# EAGLE design PaxInstruments-T100 (EAGLE 6.5.0)
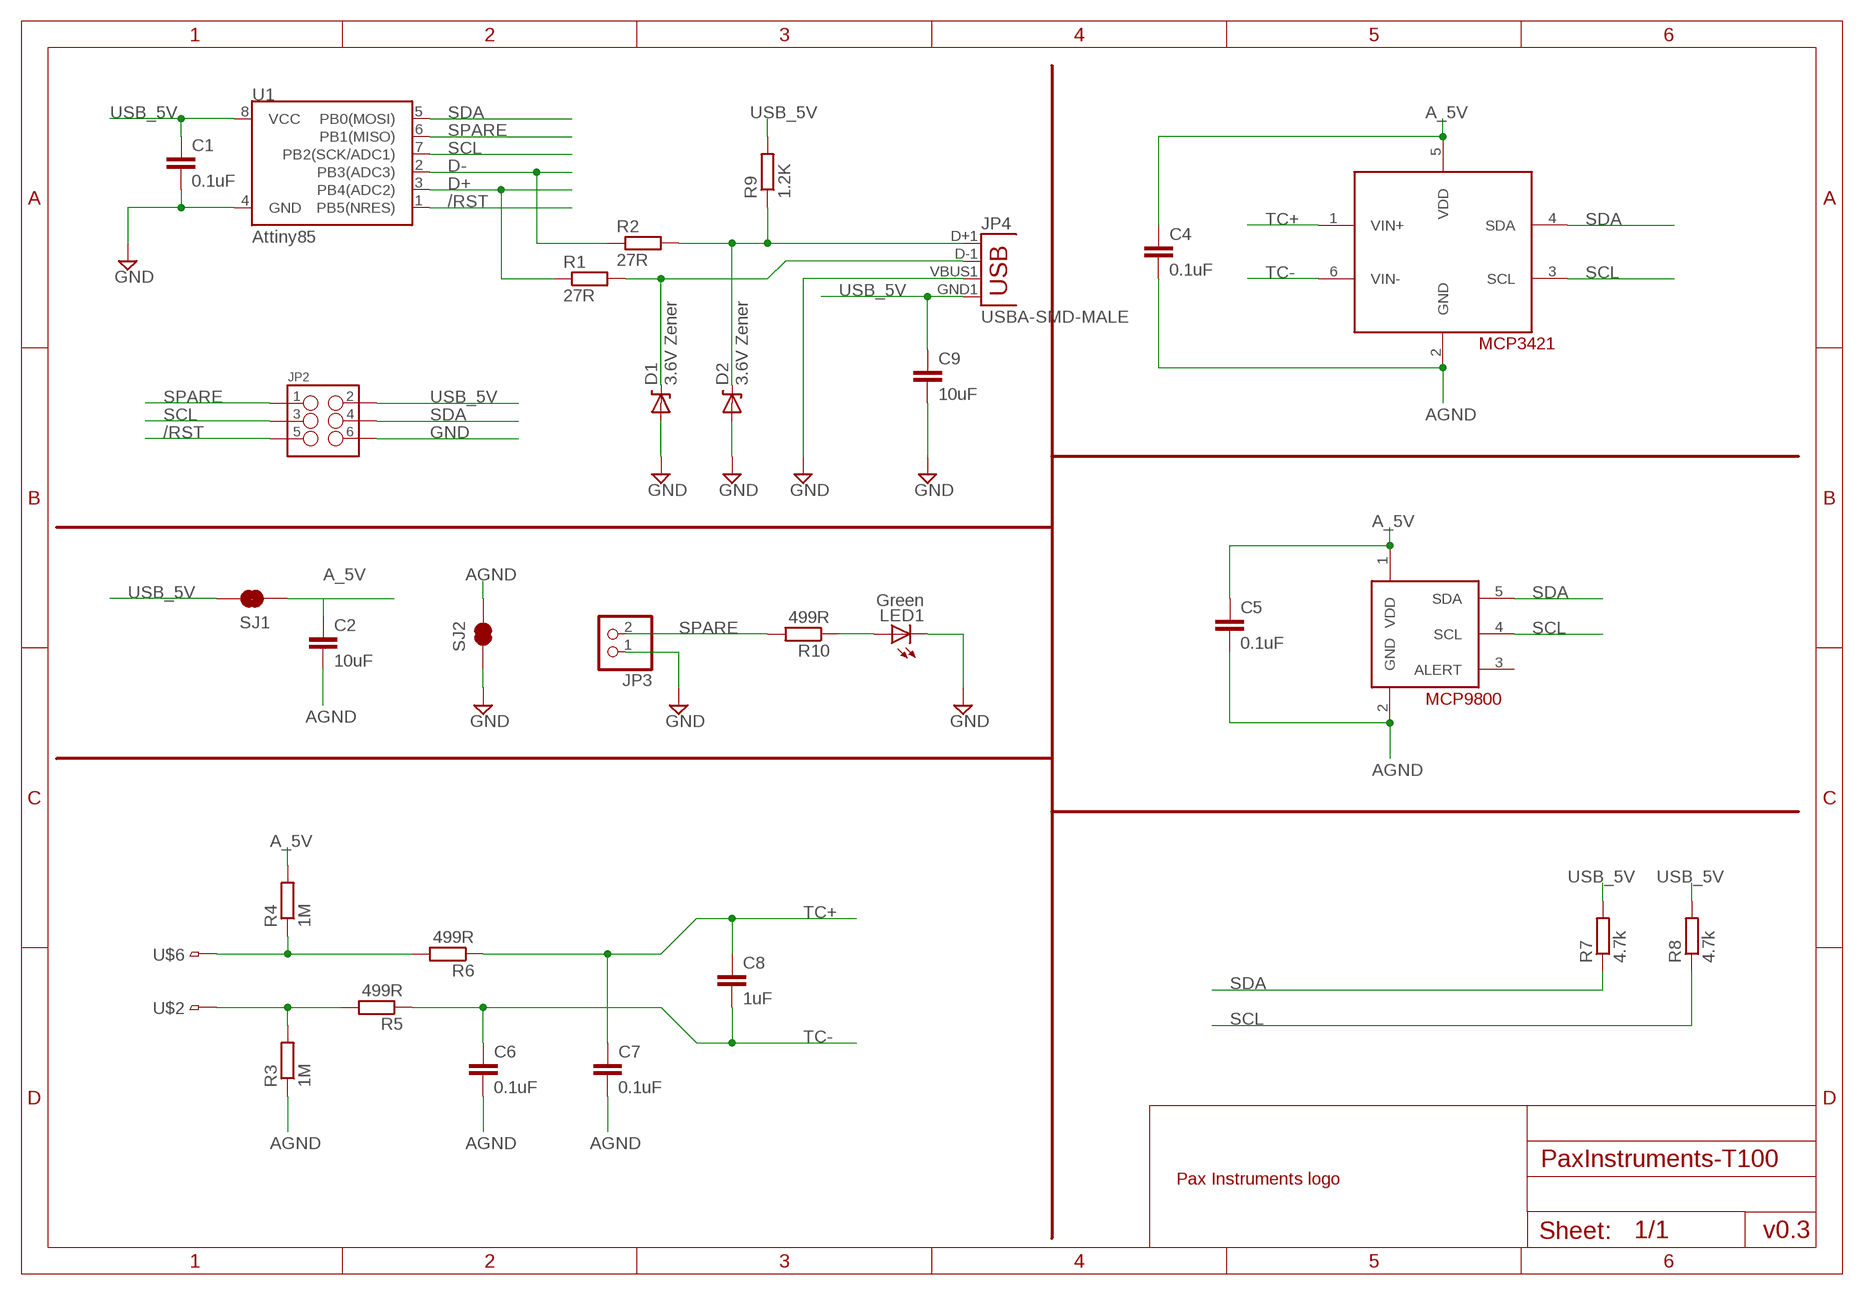
[diagram p0: schematic, sheet 1]

## Parts
C1  0.1uF  C-EUC0603  [C0603]
C2  10uF  CAP1206  [1206]
C4  0.1uF  C-EUC0603  [C0603]
C5  0.1uF  C-EUC0603  [C0603]
C6  0.1uF  C-EUC0603  [C0603]
C7  0.1uF  C-EUC0603  [C0603]
C8  1uF  C-EUC0603  [C0603]
C9  10uF  CAP1206  [1206]
D1  3.6V Zener  DIODE-ZENER-BZT52  [SOD-323]
D2  3.6V Zener  DIODE-ZENER-BZT52  [SOD-323]
JP2  M03X2SMT  [2X3_SMT_POSTS]
JP3  HEADER-1X2ROUND  [1X02_ROUND]
JP4  USBA-SMD-MALE  [USB-A-SMT-MALE]
LED1  Green  LED0603  [LED-0603]
R1  27R  R-EU_R0603  [R0603]
R2  27R  R-EU_R0603  [R0603]
R3  1M  R-EU_R0603  [R0603]
R4  1M  R-EU_R0603  [R0603]
R5  499R  R-EU_R0603  [R0603]
R6  499R  R-EU_R0603  [R0603]
R7  4.7k  R-EU_R0603  [R0603]
R8  4.7k  R-EU_R0603  [R0603]
R9  1.2K  R-EU_R0603  [R0603]
R10  499R  R-EU_R0603  [R0603]
SJ1  JUMPER-PAD-2-NC_BY_TRACENO_SILK  [PAD-JUMPER-2-NC_BY_TRACE_NO_SILK]
SJ2  JUMPER-PAD-2-NC_BY_TRACENO_SILK  [PAD-JUMPER-2-NC_BY_TRACE_NO_SILK]
U1  Attiny85  ATTINY45TINY45-20-SMT  [SO08-EIAJ]
U$1  PAX-LOGOPAX-LOGO-0.25IN  [PAX-LOGO-0.25IN]
U$2  TC-MINI-SINGLE  [TC-CLIP-SINGLE]
U$3  MCP3421A0  MCP3421  [SOT23-6]
U$4  MCP9800A0  MCP9800  [SOT23-5]
U$6  TC-MINI-SINGLE  [TC-CLIP-SINGLE]

## Nets
/RST: JP2.5 U1.1(PB5(NRES))
A_5V: C2.1 C4.1 C5.1 R4.2 SJ1.1 U$3.5(VDD) U$4.1(VDD)
AGND: C2.2 C4.2 C5.2 C6.2 C7.2 R3.1 SJ2.2 U$3.2(GND) U$4.2(GND)
D+: R1.1 U1.3(PB4(ADC2))
D-: R2.1 U1.2(PB3(ADC3))
GND: C1.2 C9.2 D1.2(A) D2.2(A) JP2.6 JP3.1 JP4.VBUS1(VBUS) LED1.C SJ2.1 U1.4(GND)
N$1: D2.1(C) JP4.D+1(D+) R2.2 R9.1
N$2: D1.1(C) JP4.D-1(D-) R1.2
N$3: R3.2 R5.2 U$2.P$1
N$4: R4.1 R6.2 U$6.P$1
N$5: LED1.A R10.1
SCL: JP2.3 R8.1 U1.7(PB2(SCK/ADC1)) U$3.3(SCL) U$4.4(SCL)
SDA: JP2.4 R7.1 U1.5(PB0(MOSI)) U$3.4(SDA) U$4.5(SDA)
SPARE: JP2.1 JP3.2 R10.2 U1.6(PB1(MISO))
TC+: C7.1 C8.1 R6.1 U$3.1(VIN+)
TC-: C6.1 C8.2 R5.1 U$3.6(VIN-)
USB_5V: C1.1 C9.1 JP2.2 JP4.GND1(GND) R7.2 R8.2 R9.2 SJ1.2 U1.8(VCC)
Unconnected: U$4.3(ALERT)

## Notes on the sheet
- v0.3

## Library data of the parts
C1 C4-C7 = rcl:C-EU: CAPACITOR, European symbol; MF: Yageo; MPN: CC0603JRX7R9BB104; OC_DIGIKEY: 311-1779-2-ND; POPULATE: generic; TOLERANCE: 5%
C2 C9 = SparkFun-Passives:CAP: Capacitor Standard 0603 ceramic capacitor, and 0.1" leaded capacitor.; MF: Yageo; MPN: CC1206KKX5R7BB106; OC_DIGIKEY: 311-1465-2-ND; POPULATE: generic; TOLERANCE: 10%
C8 = rcl:C-EU: CAPACITOR, European symbol; MF: Murata Electronics North America; MPN: GRM155R60J105KE19D; OC_DIGIKEY: 490-1320-2-ND; POPULATE: generic; TOLERANCE: 10%
D1 D2 = SparkFun-DiscreteSemi:DIODE-ZENER: Zener Diode Production Part - 8199 3.4V Zener Voltage; MF: Diodes Incorporated; MPN: BZT52C3V6S-7-F; OC_DIGIKEY: BZT52C3V6S-FDITR-ND; POPULATE: generic
JP2 = SparkFun-Connectors:M03X2: 2x3 .1" header. Shrouded, with keying- CONN-10681 SMT- CONN-11415 Pogo pins- HW-11044; MF: FCI; MPN: 95278-101A06LF; OC_DIGIKEY: 609-3487-2-ND; POPULATE: DNP; PROD_ID: CONN-11415
JP3 = microbuilder:HEADER-1X2: PIN HEADER; POPULATE: DNP
JP4 = SparkFun-Connectors:USB: USB Connectors USB-B-PTH is fully proven SKU : PRT-00139/CONN-08278 USB-miniB is fully proven SKU : PRT-00587 USB-A-PCB is untested. USB-A-H is throughly reviewed, but untested. Spark Fun Electronics SKU : PRT-00437 USB-B-SMT is throughly reviewed, but untested. Needs silkscreen touching up. USB-A-S has not been used/tested USB-MB-H has not been used/tested USB-MICROB has been used. CONN-09505
LED1 = SparkFun-LED:LED: LEDs Standard schematic elements and footprints for 5mm, 3mm, 1206, and 0603 sized LEDs. 5mm - Spark Fun Electronics SKU : COM-00529 (and others); MF: Lite-On Inc.; MPN: LTST-C191KGKT; OC_DIGIKEY: 160-1446-2-ND; POPULATE: generic
R1 R2 = rcl:R-EU_: RESISTOR, European symbol; MF: Yageo; MPN: RC0603JR-0727RL; OC_DIGIKEY: 311-27GRTR-ND; POPULATE: generic; TOLERANCE: 5%
R3 R4 = rcl:R-EU_: RESISTOR, European symbol; MF: Yageo; MPN: RC0603FR-071ML; OC_DIGIKEY: 311-1.00MHRTR-ND; POPULATE: generic; TOLERANCE: 1%
R5 R6 R10 = rcl:R-EU_: RESISTOR, European symbol; MF: Yageo; MPN: RT0603DRD07499RL; OC_DIGIKEY: 311-499DTR-ND; POPULATE: generic; TOLERANCE: 0.5%
R7 R8 = rcl:R-EU_: RESISTOR, European symbol; MF: Yageo; MPN: RC0603JR-074K7L; OC_DIGIKEY: 311-4.7KGRTR-ND; POPULATE: generic; TOLERANCE: 5%
R9 = rcl:R-EU_: RESISTOR, European symbol; MF: Yageo; MPN: RC0603JR-071K2L; OC_DIGIKEY: 311-1.2KGRTR-ND; POPULATE: generic; TOLERANCE: 5%
SJ1 SJ2 = SparkFun-Passives:JUMPER-PAD-2-NC_BY_TRACE
U1 = SparkFun-DigitalIC_ihsan:ATTINY45: Atmel 8-pin 2/4/8kB flash uC; MF: Atmel; MPN: ATTINY85-20SUR; OC_DIGIKEY: ATTINY85-20SURTR-ND; POPULATE: MPN; PROD_ID: IC-08922; VALUE: Tiny45-20-SMT
U$1 = PaxInstruments-Aesthetics:PAX-LOGO; POPULATE: DNP
U$2 U$6 = PaxInstruments-Connectors:TC-MINI-SINGLE; MF: Pax Instruments; MPN: 1024; POPULATE: MPN
U$3 = SparkFun-DigitalIC:MCP3421; MF: Microchip Technology; MPN: MCP3421A0T-E/CH; OC_DIGIKEY: MCP3421A0T-E/CHTR-ND; POPULATE: MPN
U$4 = SparkFun-DigitalIC:MCP9800; MF: Microchip Technology; MPN: MCP9800A0T-M/OT; OC_DIGIKEY: MCP9800A0T-M/OTTR-ND; POPULATE: MPN

## Board
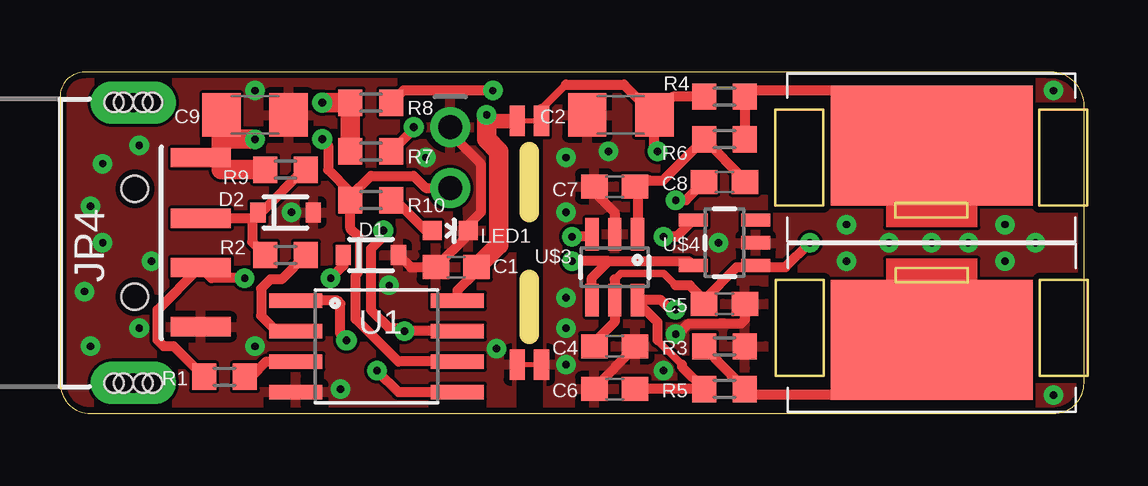
[diagram p1: board, top side]
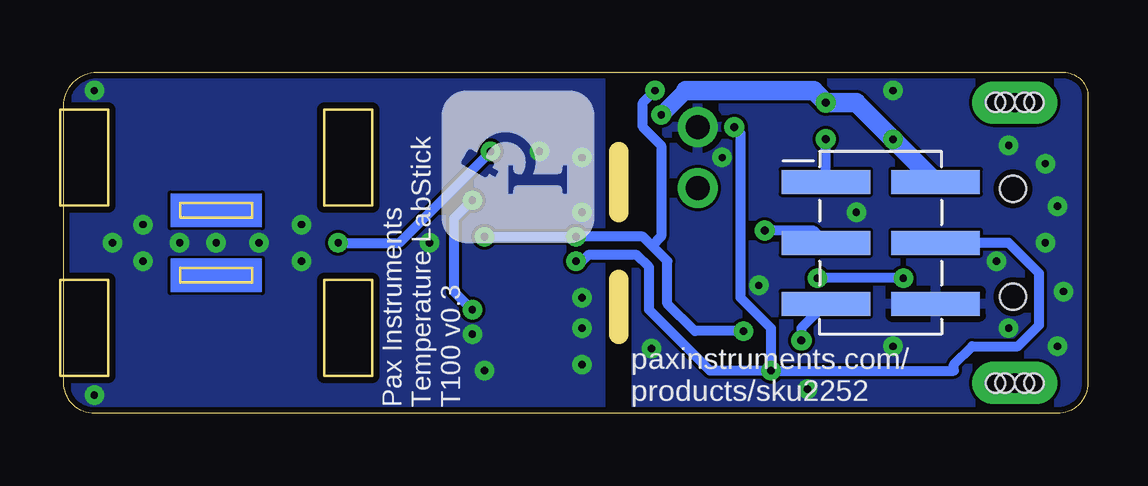
[diagram p2: board, bottom side, seen from below]

Size 42.67 x 14.23 mm. Coordinates in mm from the lower left corner, seen from the top.
Outline: 0,1.27 arc90 1.27,0 41.4,0 arc90 42.67,1.27 42.67,12.95 arc90 41.15,14.22 1.02,14.22 arc90 0,13.21 0,1.27
Copper layers (1*16): Top 0.035mm / dielectric 1.5mm / Bottom 0.035mm
Design rules "PaxInstrument-T400 *": minimum track width 6mil, minimum drill 12mil, track to track 5mil, track to pad 5mil, pad to pad 5mil, via to via 5mil, smd to smd 5mil, copper to edge 10mil, drill to drill 8mil, minimum pad ring 12mil, minimum via ring 10mil, stop-mask expansion 4mil, vias tented up to drill 25mil, thermal gap 10mil
Milling: 2 lines

### Footprints (pad centres in the part's own frame; a part is rotated, then mirrored left to right if it is on the bottom)
C0603 = smd 1.1 x 1: 1 -0.85,0; 2 0.85,0
1206 = smd 1.6 x 1.8: 1 -1.4,0; 2 1.4,0
SOD-323 = smd 0.63 x 0.83: 1 -1.15,0; 2 1.15,0
2X3_SMT_POSTS = smd 1 x 3.683: 1 -2.54,-2.286; 2 -2.54,2.286; 3 0,-2.286; 4 0,2.286; 5 2.54,-2.286; 6 2.54,2.286
1X02_ROUND = drill 1 pad 1.676: 1 -1.27,0; 2 1.27,0
USB-A-SMT-MALE = smd 0.8 x 2.5: D+1 1.027,-5.87; D-1 -1.027,-5.87; GND1 3.551,-5.87; VBUS1 -3.5,-5.87 | drill 0.8 pad 1.778 long: P$1 5.85,-3.05; P$3 -5.85,-3.05 | hole 1.1: 2.25,-3.12; -2.25,-3.12 | hole 0.8: -5.85,-3.45; -5.85,-3.85; -5.85,-2.65; -5.85,-2.25; 5.85,-3.45; 5.85,-3.85; 5.85,-2.65; 5.85,-2.25
LED-0603 = smd 0.8 x 0.8: A 0,-0.75; C 0,0.75
R0603 = smd 1 x 1.1: 1 -0.85,0; 2 0.85,0
PAD-JUMPER-2-NC_BY_TRACE_NO_SILK = smd 0.635 x 1.27: 1 -0.508,0; 2 0.508,0
SO08-EIAJ = smd 0.61 x 2.21: 1 -1.905,-3.378; 2 -0.635,-3.378; 3 0.635,-3.378; 4 1.905,-3.378; 5 1.905,3.353; 6 0.635,3.353; 7 -0.635,3.353; 8 -1.905,3.353
TC-CLIP-SINGLE = smd 5 x 8.4: P$1 -0.5,0
SOT23-6 = smd 0.55 x 1.35: 1 -0.95,-1.375; 2 0,-1.375; 3 0.95,-1.375; 4 0.95,1.375; 5 0,1.375; 6 -0.95,1.375
SOT23-5 = smd 0.55 x 1.2: 1 -0.95,-1.3; 2 0,-1.3; 3 0.95,-1.3; 4 0.95,1.3; 5 -0.95,1.3

### Placement (x,y rotation side)
C1  16.51,6.1 180 top
C2  23.37,12.45 180 top
C4  23.11,2.79 0 top
C5  27.69,4.57 0 top
C6  23.11,1.02 180 top
C7  23.11,9.46 180 top
C8  27.69,9.65 180 top
C9  8.13,12.45 0 top
D1  12.95,6.6 0 top
D2  9.4,8.38 0 top
JP2  8.64,7.11 270 bottom
JP3  16.26,10.67 270 top
JP4  0,7.11 90 top
LED1  16.26,7.62 270 top
R1  6.86,1.52 180 top
R2  9.4,6.6 180 top
R3  27.69,2.79 180 top
R4  27.69,13.21 180 top
R5  27.69,1.02 0 top
R6  27.69,11.43 0 top
R7  12.95,10.92 180 top
R8  12.95,12.95 180 top
R9  9.4,10.16 180 top
R10  12.95,8.89 180 top
SJ1  19.56,12.19 180 top
SJ2  19.56,2.03 0 top
U1  13.21,2.79 270 top
U$1  20.57,7.11 90 bottom
U$2  36.32,3.56 90 top
U$3  23.11,6.1 180 top
U$4  27.69,7.11 90 top
U$6  36.32,10.67 270 top

### Tracks (layer width: path | path; a pad name or v marks a point on that pad's centre or on a via)
/RST  (via drill 0.33 pad 0.3)
  Top 0.406: U1.1 11.56,4.7 11.68,4.57 11.68,3.3 v11.94,3.05
  Bottom 0.406: JP2.5 11.94,3.56 v11.94,3.05
A_5V  (via drill 0.3)
  Top 0.305: 23.11,5.59 23.37,5.84 25.15,5.84 25.65,5.33 | 21.08,13.72 20.07,12.7
  Top 0.406: C5.1 26.84,4.74 | 26.84,4.74 28.19,6.1 28.92,6.1 | 28.92,6.1 U$4.1 | C4.1 22.26,2.96 23.11,3.81 U$3.5 23.11,5.59 | 28.92,6.1 30.23,6.1 v31.24,7.11 | v24.89,10.92 24.77,11.05 C2.1 | 26.84,4.74 26.24,5.33 25.65,5.33 | 21.08,13.72 23.5,13.72 C2.1 | R4.2 25.53,13.21 C2.1 | 20.07,12.7 SJ1.1
  Bottom 0.406: v31.24,7.11 28.7,7.11 v24.89,10.92
AGND  (via drill 0.3)
  Top 0.406: C4.2 C6.2 22.01,1.27 | C7.2 22.26,9.23 23.11,8.38 U$3.2 | C5.2 28.54,3.9 28.37,3.73 26.19,3.73 25.76,3.3 v25.65,3.3
  other vias: 32.77,7.87 32.77,6.35 39.37,7.87 39.37,6.35 40.64,7.11 41.4,13.46 41.4,0.76 25.15,1.78 22.86,10.92 27.43,7.11 21.08,10.67 21.08,8.38 21.08,3.56 21.08,4.83 21.08,2.03 36.32,7.11 34.54,7.11 37.85,7.11
  pour Top: 20.32,14.22 20.32,0 42.67,0 42.67,14.22
  pour Bottom: 20.32,14.22 20.32,0 42.67,0 42.67,14.22
D+
  Top 0.406: U1.3 8.6,2.16 7.96,1.52 R1.1
D-
  Top 0.406: R2.1 9.23,5.59 8.76,5.59 8.38,5.21 8.38,4.06 9.02,3.43 U1.2
GND  (via drill 0.3, 0.3 pad 0.3)
  Top 0.406: D1.2 14.61,6.1 C1.2 17.01,7.44 LED1.C 17.01,7.86 17.53,8.38 17.53,10.41 16.26,11.68 JP3.1
  other vias: 1.78,7.11 13.72,5.33 11.68,1.02 18.19,2.69 8.13,2.79 1.78,10.41 1.27,2.79 3.81,6.35 15.24,10.67 8.13,13.46 9.65,8.38 3.3,11.18 1.27,8.64 1.02,5.08 3.3,3.56
  pour Bottom: 0,14.22 0,0 18.8,0 18.8,14.22
  pour Top: 0,14.22 18.8,14.22 18.8,0 0,0
N$1
  Top 0.406: JP4.D+1 8.01,8.14 | 8.01,8.14 D2.1 8.38,8.38 10.16,10.16 R9.1 | 8.01,8.14 8.01,7.15 R2.2
N$2  (via drill 0.3 pad 0.41)
  Top 0.406: R1.2 4.74,2.79 4.32,2.79 4.06,3.05 4.06,4.32 5.83,6.08 JP4.D-1 6.32,5.64 v7.7,5.64 | v11.28,5.64 11.8,6.17 D1.1
  Bottom 0.406: v7.7,5.64 v11.28,5.64
N$3
  Top 0.406: U$2.P$1 34.03,0.76 28.79,0.76 R5.2 arc-3 R3.2
N$4
  Top 0.406: U$6.P$1 34.03,13.46 28.79,13.46 R4.1 R6.2
N$5
  Top 0.406: 13.97,8.64 13.97,8.72 R10.1 13.97,8.89 15.24,7.62 LED1.A
SCL  (via drill 0.3, 0.3 pad 0.3, 0.33 pad 0.3)
  Top 0.406: U$4.4 25.69,7.37 v25.15,7.37 | U$3.3 22.06,7.37 v21.34,7.37 | U1.7 v14.35,3.43 14.22,3.56 13.72,3.56 12.95,4.32 12.95,6.86 13.46,7.37 v13.46,7.62 | v18.03,13.46 14.31,13.46 R8.1
  Bottom 0.406: v25.15,7.37 v21.34,7.37 18.54,7.37 18.16,6.99 | v14.35,3.43 16.38,3.43 17.53,4.57 17.53,6.35 18.16,6.99 | JP2.3 11.43,7.62 v13.46,7.62 | v18.03,13.46 18.54,12.95 18.54,11.94 17.78,11.18 17.78,7.37 18.16,6.99
SDA  (via drill 0.3 pad 0.3, 0.33 pad 0.3)
  Top 0.406: U$3.4 22.16,5.65 22.86,6.35 | 22.86,6.35 26.2,6.35 U$4.5 | 22.86,6.35 v21.34,6.35 | v13.21,1.78 14.1,0.89 U1.5 | R7.1 14.73,11.85 v14.73,11.94
  Bottom 0.406: v21.34,6.35 21.08,6.35 20.83,6.6 18.8,6.6 18.29,6.1 18.29,4.32 15.75,1.78 v13.21,1.78 | v13.21,1.78 5.59,1.78 5.59,2.03 4.83,2.79 2.92,2.79 2.03,3.68 2.03,5.84 3.3,7.11 JP2.4 | v13.21,1.78 13.21,3.56 14.48,4.83 14.48,11.68 v14.73,11.94
SPARE  (via drill 0.33 pad 0.3)
  Top 0.305: 12.32,5.71 12.45,5.84 12.45,7.37
  Top 0.406: U1.6 14.1,2.16 12.32,3.94 12.32,5.71 | 12.45,7.37 12.1,7.71 R10.2 | R10.2 12.1,9.06 12.95,9.91 14.73,9.91 15.24,9.4 JP3.2 | v10.92,11.43 11.18,11.18 11.18,10.16 12.1,9.23 R10.2
  Bottom 0.406: JP2.1 v10.92,11.43
TC+
  Top 0.406: C8.1 28.54,9.73 R6.1 | R6.1 26.58,11.18 | U$3.1 24.06,9.36 C7.1 24.22,9.71 | 24.19,9.71 24.22,9.71 | R6.1 25.12,9.71 24.56,9.71 24.22,9.71
TC-  (via drill 0.3)
  Top 0.305: 24.89,3.05 25.91,2.03
  Top 0.406: R5.1 C6.1 | R5.1 25.91,1.02 | 24.89,3.05 24.89,3.81 24.32,4.38 24.06,4.38 U$3.6 25.04,4.72 25.55,4.21 v25.65,4.32 | 25.91,2.03 25.91,1.94 R5.1 | C8.2 26.07,8.89 v25.65,8.89
  Bottom 0.406: v25.65,8.89 26.42,8.13 26.42,5.08 v25.65,4.32
USB_5V  (via drill 0.3 pad 0.3, 0.33 pad 0.3)
  Top 0.406: C1.1 17.27,6.01 17.27,5.84 16.56,5.13 U1.8
  Top 0.61: SJ1.2 18.03,12.19 v17.78,12.45
  Top 0.813: JP4.GND1 6.73,10.66 | 6.73,10.66 6.73,11.68 | 6.73,11.68 C9.1 | R9.2 6.73,10.16 6.73,10.66 | v8.13,11.43 6.98,11.43 arc-90 6.73,11.68 | R7.2 R8.2 v10.92,12.95 | C1.1 18.29,7.02 18.29,10.92 17.78,11.43 v17.78,12.45
  Bottom 0.711: 16.76,13.46 v17.78,12.45
  Bottom 0.813: JP2.2 v8.13,11.43 9.65,12.95 v10.92,12.95 11.43,13.46 16.76,13.46

### Text on the board
bPlace: paxinstruments.com/ / products/sku2252 | Pax Instruments / Temperature LabStick / T100 v0.3
Document: Keep edge clean
bDocu: TC+